# Altium schematic sheet Backplane.SchDoc: Backplane Interface
size A1 portrait; Revision: 1A; SheetNumber: 1; SheetTotal: 1; Organization: Brickworks; Address1: Matthew Glazer; Address2: Design Engineer
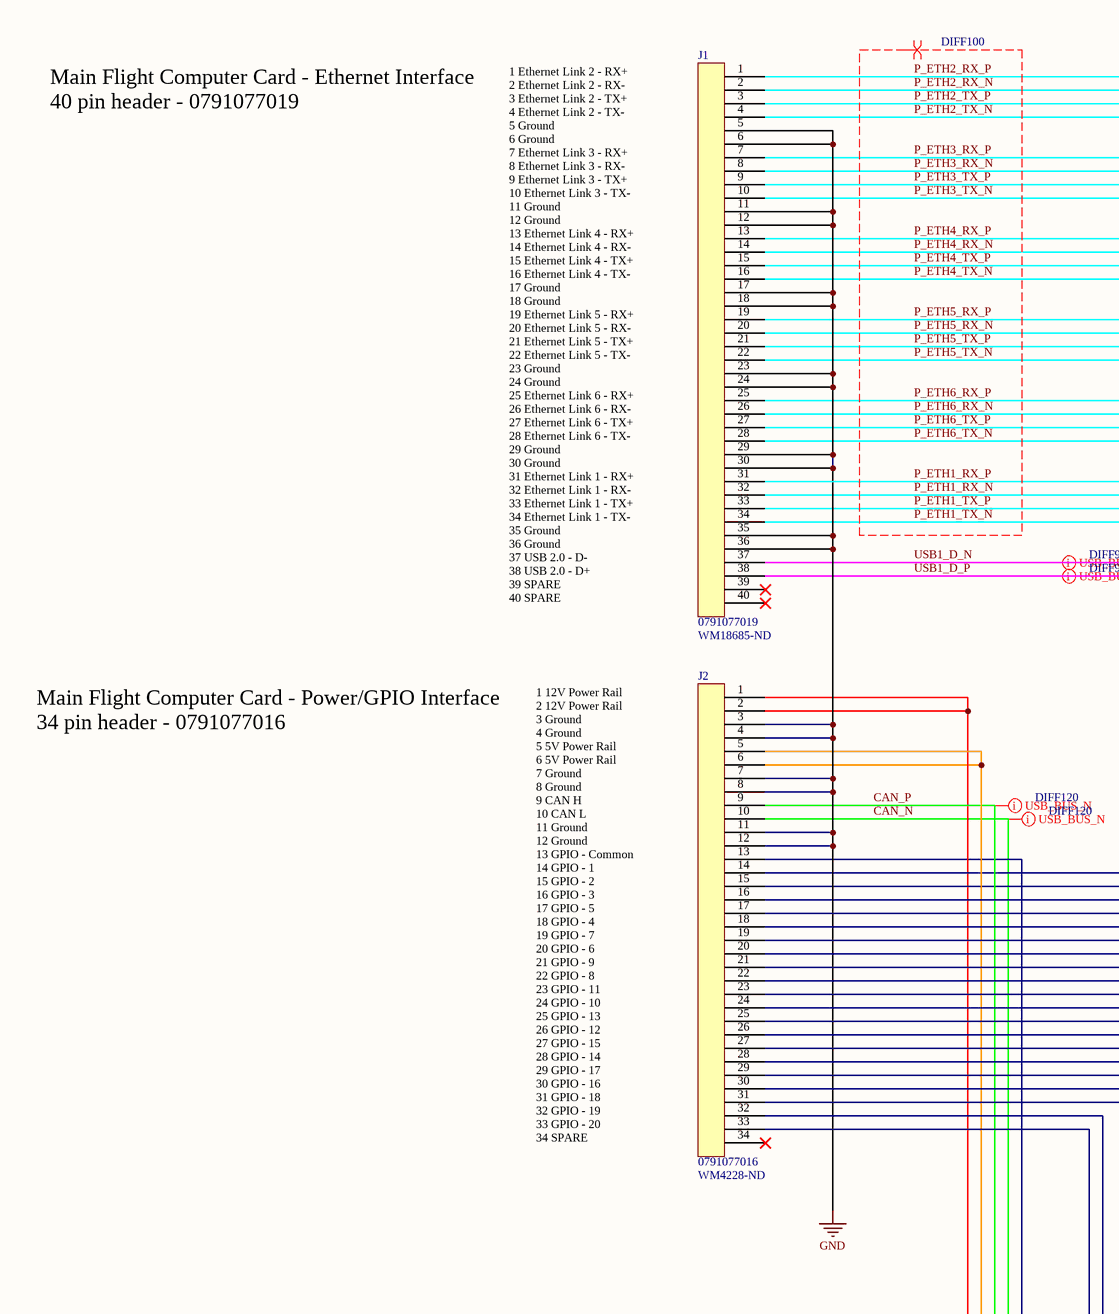
[diagram p0: Backplane.SchDoc, top left]
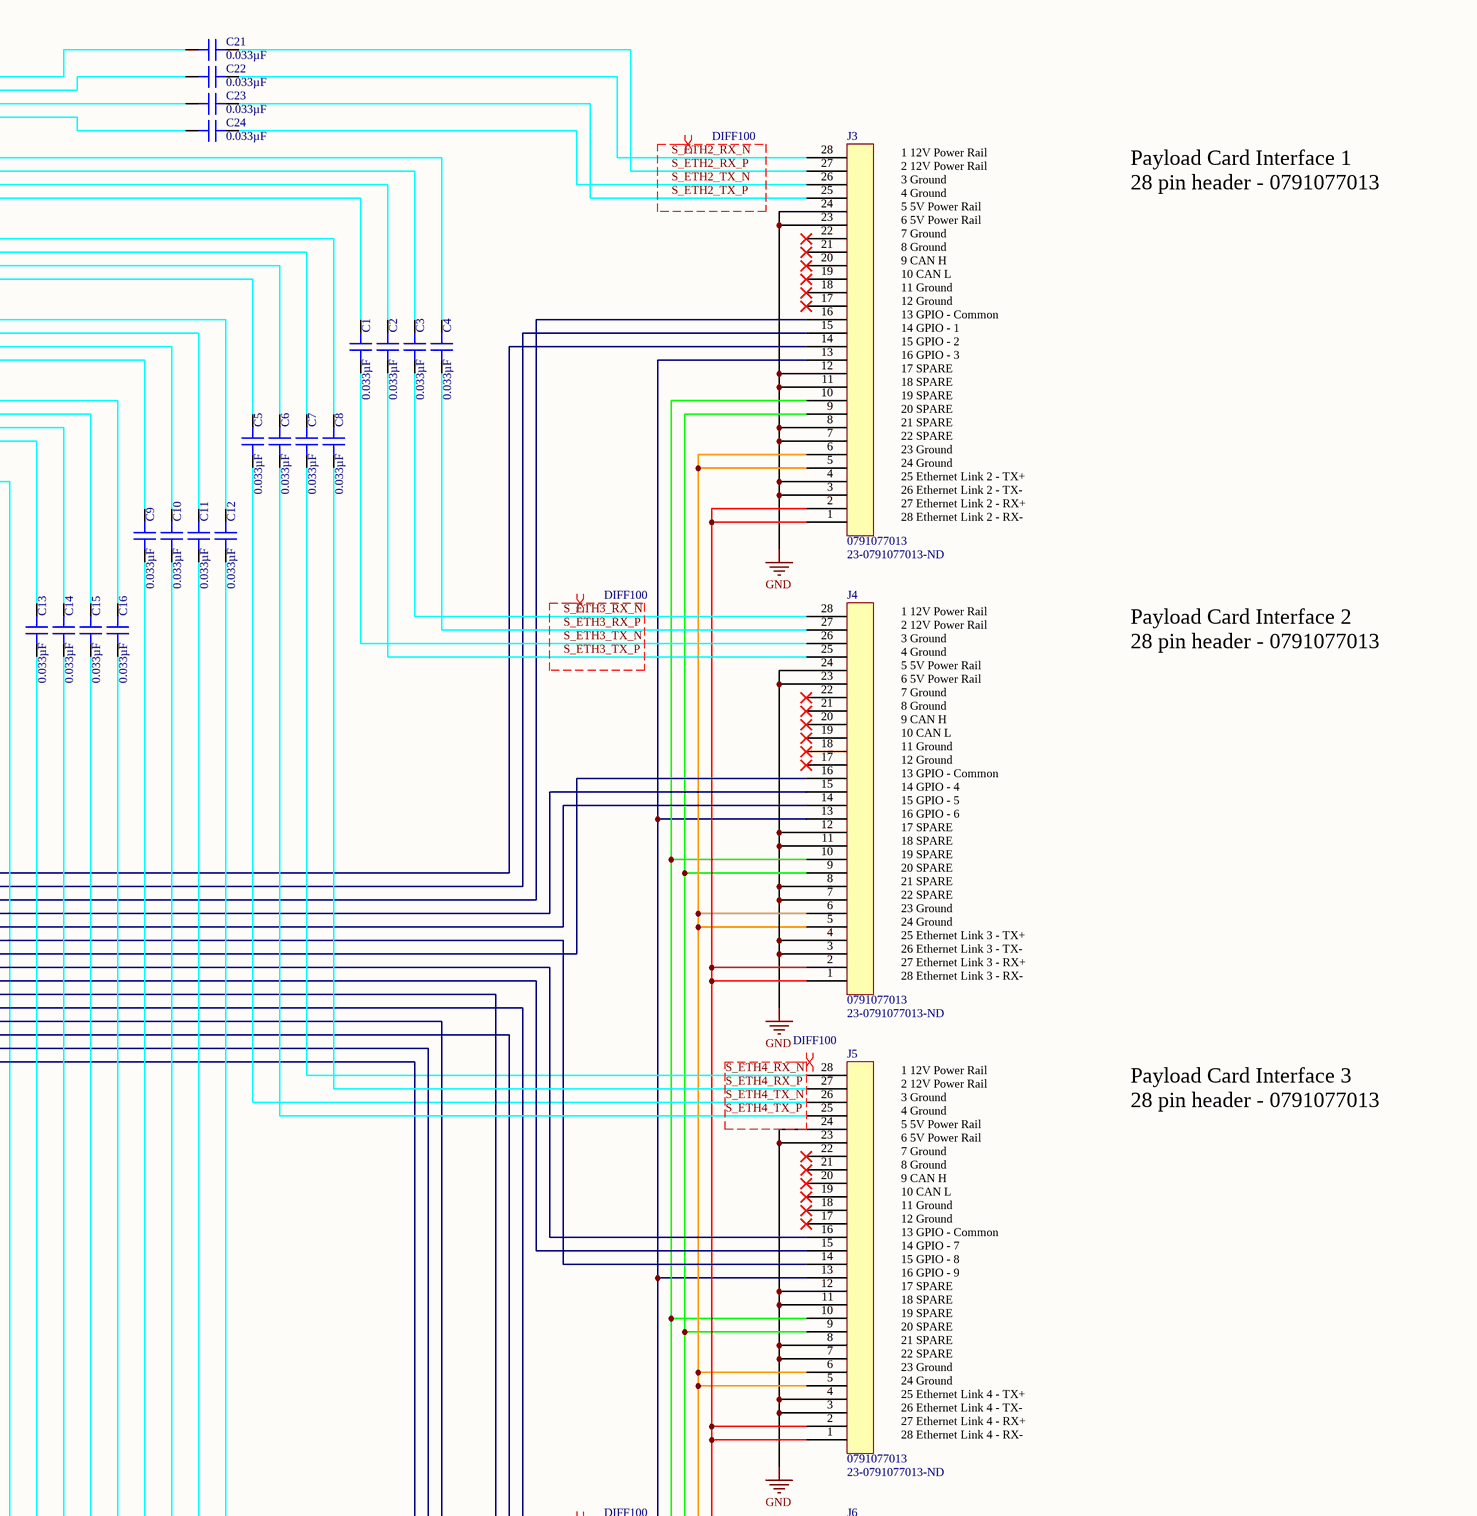
[diagram p1: Backplane.SchDoc, top right]
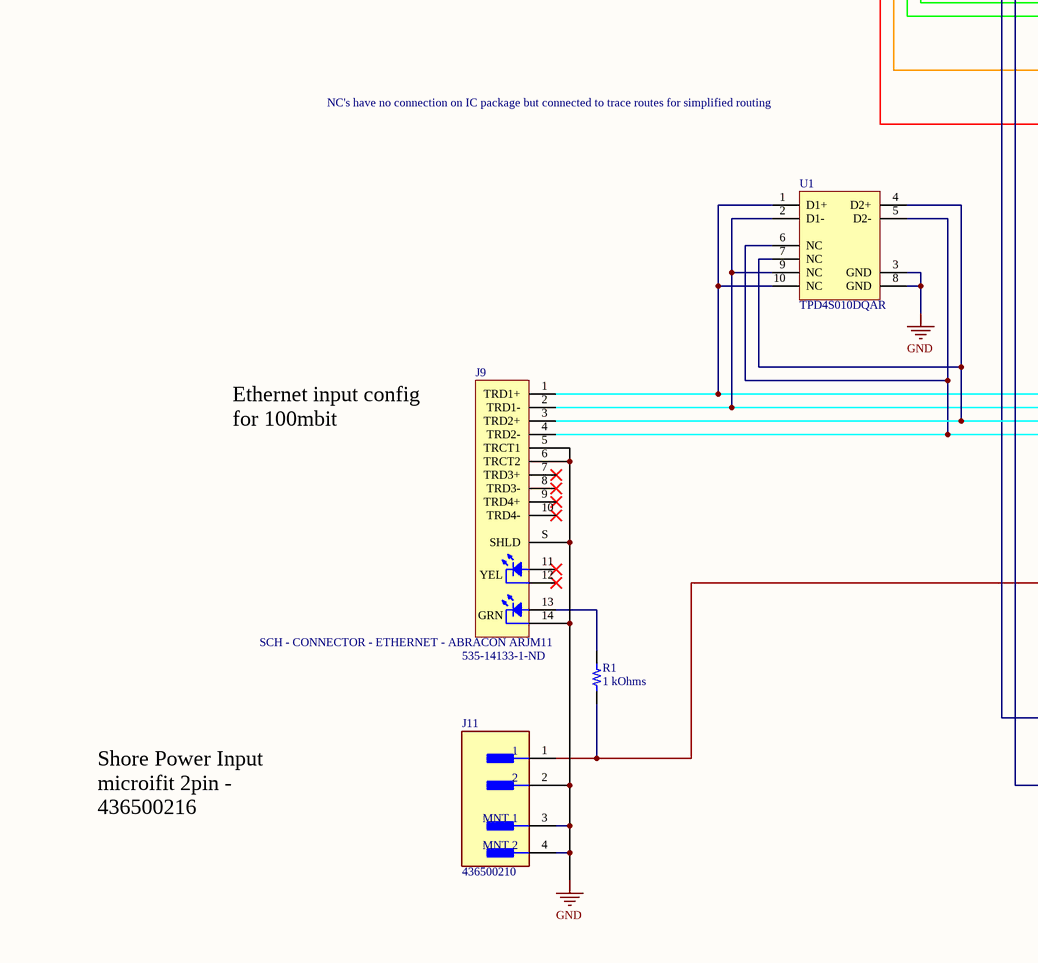
[diagram p2: Backplane.SchDoc, bottom left]
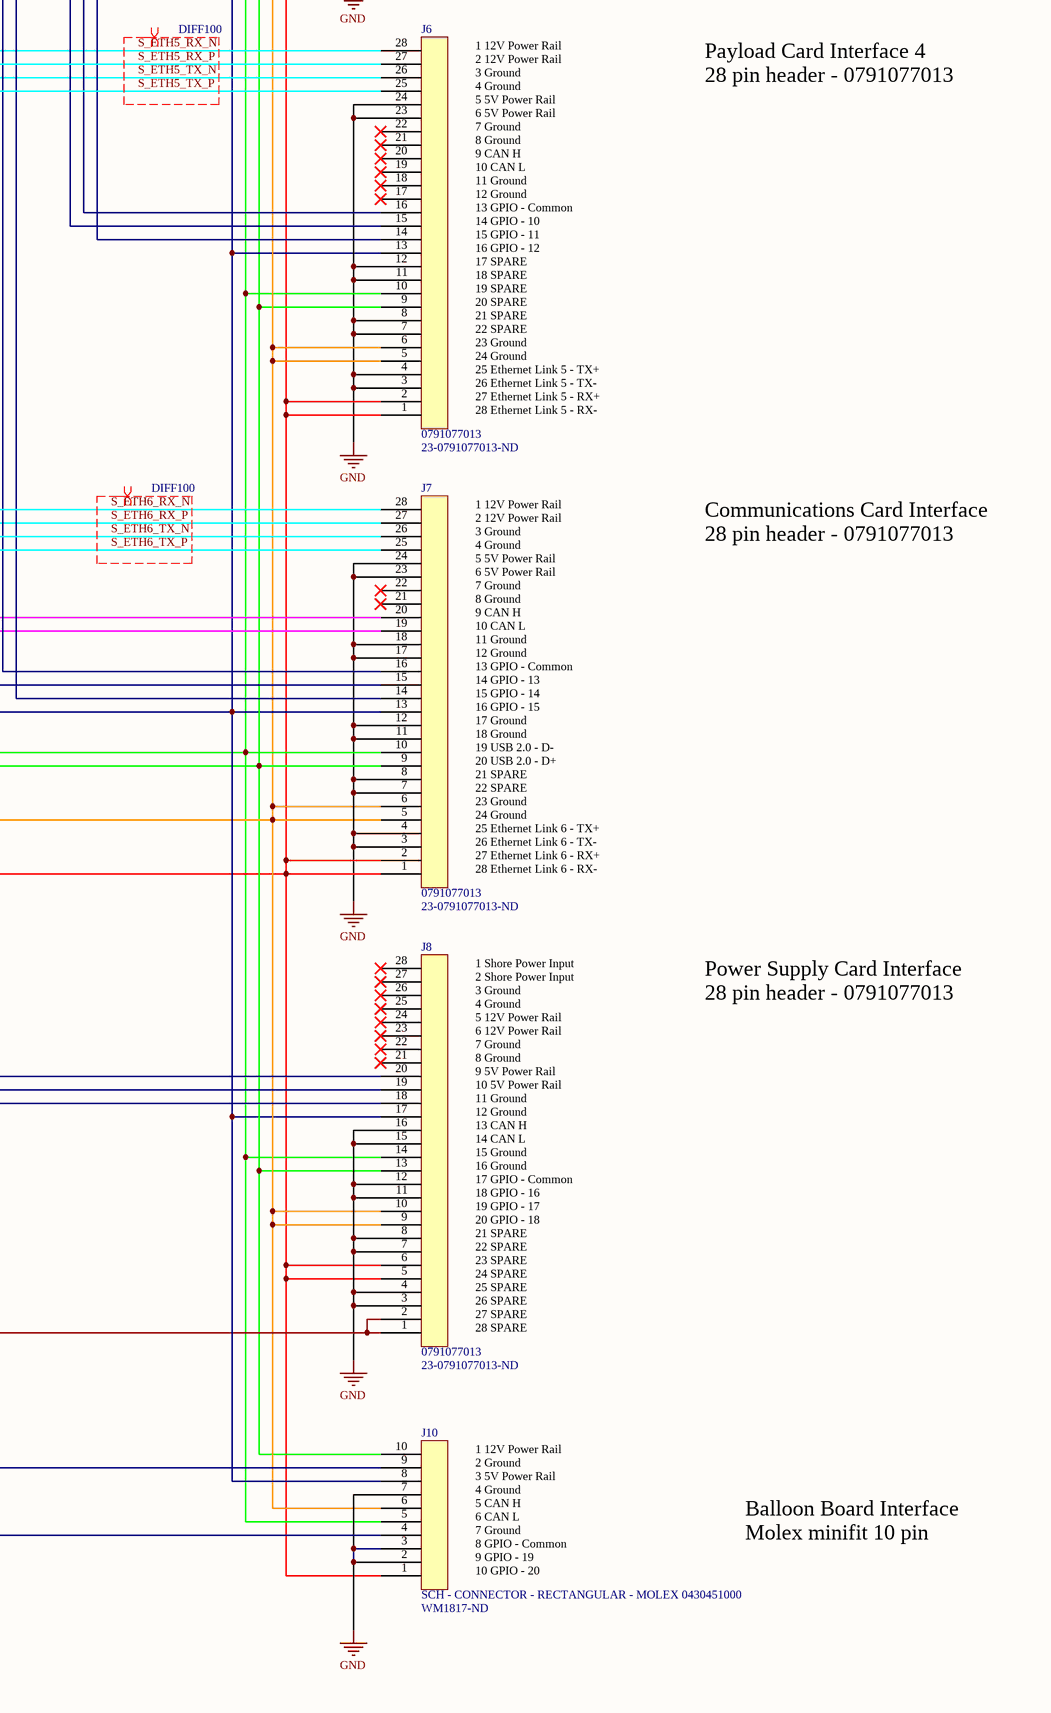
[diagram p3: Backplane.SchDoc, bottom right]

## Parts
C1  0.033µF  [CAP 0603_1608]
C2  0.033µF  [CAP 0603_1608]
C3  0.033µF  [CAP 0603_1608]
C4  0.033µF  [CAP 0603_1608]
C5  0.033µF  [CAP 0603_1608]
C6  0.033µF  [CAP 0603_1608]
C7  0.033µF  [CAP 0603_1608]
C8  0.033µF  [CAP 0603_1608]
C9  0.033µF  [CAP 0603_1608]
C10  0.033µF  [CAP 0603_1608]
C11  0.033µF  [CAP 0603_1608]
C12  0.033µF  [CAP 0603_1608]
C13  0.033µF  [CAP 0603_1608]
C14  0.033µF  [CAP 0603_1608]
C15  0.033µF  [CAP 0603_1608]
C16  0.033µF  [CAP 0603_1608]
C21  0.033µF  [CAP 0603_1608]
C22  0.033µF  [CAP 0603_1608]
C23  0.033µF  [CAP 0603_1608]
C24  0.033µF  [CAP 0603_1608]
J1  0791077019  Supplier Part Number 1: WM18685-ND  [0791077019]
J2  0791077016  Supplier Part Number 1: WM4228-ND  [0791077016]
J3  0791077013  Supplier Part Number 1: 23-0791077013-ND  [0791077013]
J4  0791077013  Supplier Part Number 1: 23-0791077013-ND  [0791077013]
J5  0791077013  Supplier Part Number 1: 23-0791077013-ND  [0791077013]
J6  0791077013  Supplier Part Number 1: 23-0791077013-ND  [0791077013]
J7  0791077013  Supplier Part Number 1: 23-0791077013-ND  [0791077013]
J8  0791077013  Supplier Part Number 1: 23-0791077013-ND  [0791077013]
J9  SCH - CONNECTOR - ETHERNET - ABRACON ARJM11  Supplier Part Number 1: 535-14133-1-ND  [PCB - CONNECTOR - MODULAR - ETHERNET - ABRACON ARJM11]
J10  SCH - CONNECTOR - RECTANGULAR - MOLEX 0430451000  Supplier Part Number 1: WM1817-ND  [PCB - CONNECTOR - RECTANGULAR - MOLEX 0430451000]
J11  436500210  [FP-436500210-MFG]
R1  1 kOhms  [RES 0603_1608]
U1  TPD4S010DQAR  [DQA0010A_V]

## Nets
GND: J1.5 J1.6 J1.11 J1.12 J1.17 J1.18 J1.23 J1.24 J1.29 J1.30 J1.35 J1.36 J2.3 J2.4 J2.7 J2.8 J2.11 J2.12 J3.3 J3.4 J3.7 J3.8 J3.11 J3.12 J3.23 J3.24 J4.3 J4.4 J4.7 J4.8 J4.11 J4.12 J4.23 J4.24 J5.3 J5.4 J5.7 J5.8 J5.11 J5.12 J5.23 J5.24 J6.3 J6.4 J6.7 J6.8 J6.11 J6.12 J6.23 J6.24 J7.3 J7.4 J7.7 J7.8 J7.11 J7.12 J7.17 J7.18 J7.23 J7.24 J8.3 J8.4 J8.7 J8.8 J8.11 J8.12 J8.15 J8.16 J9.5(TRCT1) J9.6(TRCT2) J9.14(L4) J9.S(SHLD) J10.2 J10.3 J10.7 J11.2 J11.3(MNT_1) J11.4(MNT_2) U1.3(GND) U1.8(GND)
CAN_N: J2.10 J3.10 J4.10 J5.10 J6.10 J7.10 J8.14 J10.5
CAN_P: J2.9 J3.9 J4.9 J5.9 J6.9 J7.9 J8.13 J10.10
P_ETH1_RX_N: J1.32 J9.4(TRD2-) U1.5(D2-) U1.6(NC)
P_ETH1_RX_P: J1.31 J9.3(TRD2+) U1.4(D2+) U1.7(NC)
P_ETH1_TX_N: J1.34 J9.2(TRD1-) U1.2(D1-) U1.9(NC)
P_ETH1_TX_P: J1.33 J9.1(TRD1+) U1.1(D1+) U1.10(NC)
P_ETH2_RX_N: C22.2 J1.2
P_ETH2_RX_P: C21.2 J1.1
P_ETH2_TX_N: C24.2 J1.4
P_ETH2_TX_P: C23.2 J1.3
P_ETH3_RX_N: C3.2 J1.8
P_ETH3_RX_P: C4.2 J1.7
P_ETH3_TX_N: C1.2 J1.10
P_ETH3_TX_P: C2.2 J1.9
P_ETH4_RX_N: C7.2 J1.14
P_ETH4_RX_P: C8.2 J1.13
P_ETH4_TX_N: C5.2 J1.16
P_ETH4_TX_P: C6.2 J1.15
P_ETH5_RX_N: C11.2 J1.20
P_ETH5_RX_P: C12.2 J1.19
P_ETH5_TX_N: C9.2 J1.22
P_ETH5_TX_P: C10.2 J1.21
P_ETH6_RX_N: C15.2 J1.26
P_ETH6_RX_P: C16.2 J1.25
P_ETH6_TX_N: C13.2 J1.28
P_ETH6_TX_P: C14.2 J1.27
S_ETH2_RX_N: C22.1 J3.28
S_ETH2_RX_P: C21.1 J3.27
S_ETH2_TX_N: C24.1 J3.26
S_ETH2_TX_P: C23.1 J3.25
S_ETH3_RX_N: C3.1 J4.28
S_ETH3_RX_P: C4.1 J4.27
S_ETH3_TX_N: C1.1 J4.26
S_ETH3_TX_P: C2.1 J4.25
S_ETH4_RX_N: C7.1 J5.28
S_ETH4_RX_P: C8.1 J5.27
S_ETH4_TX_N: C5.1 J5.26
S_ETH4_TX_P: C6.1 J5.25
S_ETH5_RX_N: C11.1 J6.28
S_ETH5_RX_P: C12.1 J6.27
S_ETH5_TX_N: C9.1 J6.26
S_ETH5_TX_P: C10.1 J6.25
S_ETH6_RX_N: C15.1 J7.28
S_ETH6_RX_P: C16.1 J7.27
S_ETH6_TX_N: C13.1 J7.26
S_ETH6_TX_P: C14.1 J7.25
USB1_D_N: J1.37 J7.19
USB1_D_P: J1.38 J7.20
NetJ2_1: J2.1 J2.2 J3.1 J3.2 J4.1 J4.2 J5.1 J5.2 J6.1 J6.2 J7.1 J7.2 J8.5 J8.6 J10.1
NetJ2_5: J2.5 J2.6 J3.5 J3.6 J4.5 J4.6 J5.5 J5.6 J6.5 J6.6 J7.5 J7.6 J8.9 J8.10 J10.6
NetJ2_13: J2.13 J3.13 J4.13 J5.13 J6.13 J7.13 J8.17 J10.8
NetJ2_14: J2.14 J3.14
NetJ2_15: J2.15 J3.15
NetJ2_16: J2.16 J3.16
NetJ2_17: J2.17 J4.15
NetJ2_18: J2.18 J4.14
NetJ2_19: J2.19 J5.14
NetJ2_20: J2.20 J4.16
NetJ2_21: J2.21 J5.16
NetJ2_22: J2.22 J5.15
NetJ2_23: J2.23 J6.15
NetJ2_24: J2.24 J6.14
NetJ2_25: J2.25 J7.14
NetJ2_26: J2.26 J6.16
NetJ2_27: J2.27 J7.16
NetJ2_28: J2.28 J7.15
NetJ2_29: J2.29 J8.19
NetJ2_30: J2.30 J8.18
NetJ2_31: J2.31 J8.20
NetJ2_32: J2.32 J10.4
NetJ2_33: J2.33 J10.9
NetJ8_1: J8.1 J8.2 J11.1 R1.2
NetJ9_13: J9.13(L3) R1.1

Not connected (* = marked no-connect by the designer): J1 39* 40*; J2 34*; J3 17* 18* 19* 20* 21* 22*; J4 17* 18* 19* 20* 21* 22*; J5 17* 18* 19* 20* 21* 22*; J6 17* 18* 19* 20* 21* 22*; J7 21* 22*; J8 21* 22* 23* 24* 25* 26* 27* 28*; J9 7(TRD3+)* 8(TRD3-)* 9(TRD4+)* 10(TRD4-)* 11(L1)* 12(L2)*

## Layout directives
differential pair; differential pair class DIFF100: P_ETH1_RX_N, P_ETH1_RX_P, P_ETH1_TX_N, P_ETH1_TX_P, P_ETH2_RX_N, P_ETH2_RX_P, P_ETH2_TX_N, P_ETH2_TX_P, P_ETH3_RX_N, P_ETH3_RX_P, P_ETH3_TX_N, P_ETH3_TX_P, P_ETH4_RX_N, P_ETH4_RX_P, P_ETH4_TX_N, P_ETH4_TX_P, P_ETH5_RX_N, P_ETH5_RX_P, P_ETH5_TX_N, P_ETH5_TX_P, P_ETH6_RX_N, P_ETH6_RX_P, P_ETH6_TX_N, P_ETH6_TX_P, S_ETH2_RX_N, S_ETH2_RX_P, S_ETH2_TX_N, S_ETH2_TX_P, S_ETH3_RX_N, S_ETH3_RX_P, S_ETH3_TX_N, S_ETH3_TX_P, S_ETH4_RX_N, S_ETH4_RX_P, S_ETH4_TX_N, S_ETH4_TX_P, S_ETH5_RX_N, S_ETH5_RX_P, S_ETH5_TX_N, S_ETH5_TX_P, S_ETH6_RX_N, S_ETH6_RX_P, S_ETH6_TX_N, S_ETH6_TX_P
differential pair; differential pair class DIFF90: USB1_D_N, USB1_D_P
differential pair; differential pair class DIFF120: CAN_N, CAN_P

## Notes on the sheet
- Main Flight Computer Card - Ethernet Interface
  40 pin header - 0791077019
- Payload Card Interface 1
  28 pin header - 0791077013
- 1	12V Power Rail
  2	12V Power Rail
  3	Ground
  4	Ground
  5	5V Power Rail
  6	5V Power Rail
  7	Ground
  8	Ground
  9	CAN H
  10	CAN L
  11	Ground
  12	Ground
  13	GPIO - Common
  14	GPIO - 1
  15	GPIO - 2
  16	GPIO - 3
  17	SPARE
  18	SPARE
  19	SPARE
  20	SPARE
  21	SPARE
  22	SPARE
  23	Ground
  24	Ground
  25	Ethernet Link 2 - TX+
  26	Ethernet Link 2 - TX-
  27	Ethernet Link 2 - RX+
  28	Ethernet Link 2 - RX-
- (near J1) 1	Ethernet Link 2 - RX+
  2	Ethernet Link 2 - RX-
  3	Ethernet Link 2 - TX+
  4	Ethernet Link 2 - TX-
  5	Ground
  6	Ground
  7	Ethernet Link 3 - RX+
  8	Ethernet Link 3 - RX-
  9	Ethernet Link 3 - TX+
  10	Ethernet Link 3 - TX-
  11	Ground
  12	Ground
  13	Ethernet Link 4 - RX+
  14	Ethernet Link 4 - RX-
  15	Ethernet Link 4 - TX+
  16	Ethernet Link 4 - TX-
  17	Ground
  18	Ground
  19	Ethernet Link 5 - RX+
  20	Ethernet Link 5 - RX-
  21	Ethernet Link 5 - TX+
  22	Ethernet Link 5 - TX-
  23	Ground
  24	Ground
  25	Ethernet Link 6 - RX+
  26	Ethernet Link 6 - RX-
  27	Ethernet Link 6 - TX+
  28	Ethernet Link 6 - TX-
  29	Ground
  30	Ground
  31	Ethernet Link 1 - RX+
  32	Ethernet Link 1 - RX-
  33	Ethernet Link 1 - TX+
  34	Ethernet Link 1 - TX-
  35	Ground
  36	Ground
  37	USB 2.0 - D-
  38	USB 2.0 - D+
  39	SPARE
  40	SPARE
- Payload Card Interface 2
  28 pin header - 0791077013
- Main Flight Computer Card - Power/GPIO Interface
  34 pin header - 0791077016
- 1	12V Power Rail
  2	12V Power Rail
  3	Ground
  4	Ground
  5	5V Power Rail
  6	5V Power Rail
  7	Ground
  8	Ground
  9	CAN H
  10	CAN L
  11	Ground
  12	Ground
  13	GPIO - Common
  14	GPIO - 4
  15	GPIO - 5
  16	GPIO - 6
  17	SPARE
  18	SPARE
  19	SPARE
  20	SPARE
  21	SPARE
  22	SPARE
  23	Ground
  24	Ground
  25	Ethernet Link 3 - TX+
  26	Ethernet Link 3 - TX-
  27	Ethernet Link 3 - RX+
  28	Ethernet Link 3 - RX-
- Payload Card Interface 3
  28 pin header - 0791077013
- (near J2) 1	12V Power Rail
  2	12V Power Rail
  3	Ground
  4	Ground
  5	5V Power Rail
  6	5V Power Rail
  7	Ground
  8	Ground
  9	CAN H
  10	CAN L
  11	Ground
  12	Ground
  13	GPIO - Common
  14	GPIO - 1
  15	GPIO - 2
  16	GPIO - 3
  17	GPIO - 5
  18	GPIO - 4
  19	GPIO - 7
  20	GPIO - 6
  21	GPIO - 9
  22	GPIO - 8
  23	GPIO - 11
  24	GPIO - 10
  25	GPIO - 13
  26	GPIO - 12
  27	GPIO - 15
  28	GPIO - 14
  29	GPIO - 17
  30	GPIO - 16
  31	GPIO - 18
  32	GPIO - 19
  33	GPIO - 20
  34	SPARE
- 1	12V Power Rail
  2	12V Power Rail
  3	Ground
  4	Ground
  5	5V Power Rail
  6	5V Power Rail
  7	Ground
  8	Ground
  9	CAN H
  10	CAN L
  11	Ground
  12	Ground
  13	GPIO - Common
  14	GPIO - 7
  15	GPIO - 8
  16	GPIO - 9
  17	SPARE
  18	SPARE
  19	SPARE
  20	SPARE
  21	SPARE
  22	SPARE
  23	Ground
  24	Ground
  25	Ethernet Link 4 - TX+
  26	Ethernet Link 4 - TX-
  27	Ethernet Link 4 - RX+
  28	Ethernet Link 4 - RX-
- Payload Card Interface 4
  28 pin header - 0791077013
- 1	12V Power Rail
  2	12V Power Rail
  3	Ground
  4	Ground
  5	5V Power Rail
  6	5V Power Rail
  7	Ground
  8	Ground
  9	CAN H
  10	CAN L
  11	Ground
  12	Ground
  13	GPIO - Common
  14	GPIO - 10
  15	GPIO - 11
  16	GPIO - 12
  17	SPARE
  18	SPARE
  19	SPARE
  20	SPARE
  21	SPARE
  22	SPARE
  23	Ground
  24	Ground
  25	Ethernet Link 5 - TX+
  26	Ethernet Link 5 - TX-
  27	Ethernet Link 5 - RX+
  28	Ethernet Link 5 - RX-
- Communications Card Interface
  28 pin header - 0791077013
- NC's have no connection on IC package but connected to trace routes for simplified routing
- 1	12V Power Rail
  2	12V Power Rail
  3	Ground
  4	Ground
  5	5V Power Rail
  6	5V Power Rail
  7	Ground
  8	Ground
  9	CAN H
  10	CAN L
  11	Ground
  12	Ground
  13	GPIO - Common
  14	GPIO - 13
  15	GPIO - 14
  16	GPIO - 15
  17	Ground
  18	Ground
  19	USB 2.0 - D-
  20	USB 2.0 - D+
  21	SPARE
  22	SPARE
  23	Ground
  24	Ground
  25	Ethernet Link 6 - TX+
  26	Ethernet Link 6 - TX-
  27	Ethernet Link 6 - RX+
  28	Ethernet Link 6 - RX-
- Power Supply Card Interface
  28 pin header - 0791077013
- Ethernet input config for 100mbit
- 1	Shore Power Input
  2	Shore Power Input
  3	Ground
  4	Ground
  5	12V Power Rail
  6	12V Power Rail
  7	Ground
  8	Ground
  9	5V Power Rail
  10	5V Power Rail
  11	Ground
  12	Ground
  13	CAN H
  14	CAN L
  15	Ground
  16	Ground
  17	GPIO - Common
  18	GPIO - 16
  19	GPIO - 17
  20	GPIO - 18
  21	SPARE
  22	SPARE
  23	SPARE
  24	SPARE
  25	SPARE
  26	SPARE
  27	SPARE
  28	SPARE
- Shore Power Input
  microifit 2pin - 436500216
  Cable: 1451320200
- 1	12V Power Rail
  2	Ground
  3	5V Power Rail
  4	Ground
  5	CAN H
  6	CAN L
  7	Ground
  8	GPIO - Common
  9	GPIO - 19
  10	GPIO - 20
- Balloon Board Interface
  Molex minifit 10 pin
- Title
- Size:
- Date:
- File:
- A1
- Number:
- Time:
- Revision:
- Sheet
- of
- (in symbol SCH - CONNECTOR - ETHERNET - ABRACON ARJM11) YEL; GRN

## Library data of the parts
C1-C16 C21-C24 = CL10B333KB8NFNC: CAP CER 0.033UF 50V X7R 0603; Manufacturer: Samsung Electro-Mechanics; Tolerance: ±10%; Part Number: CL10B333KB8NFNC; Value: 0.033µF; Applications: General Purpose; Capacitance: 0.033µF; ComponentLink1Description: Datasheet; ComponentLink1URL: http://www.samsungsem.com/kr/support/product-search/mlcc/CL10B333KB8NFNC.jsp; ComponentLink2Description: DigiKey Link; ComponentLink2URL: http://digikey.com/product-detail/en/samsung-electro-mechanics/CL10B333KB8NFNC/1276-2040-1-ND/3890126; Device Package: 0603 (1608 Metric); LastUpdated: 8/13/2020 10:21:44 AM; Lifecycle Status: Active; Minimum Order: 1; Mounting Type: Surface Mount, MLCC; Operating Temperature: -55°C ~ 125°C; Package / Case: 0603 (1608 Metric); Packaging: TapeAndReel; PartId: 14254; Part Status: Active; Price: 0.01; Series: CL; Size / Dimension: 0.063" L x 0.031" W (1.60mm x 0.80mm); Supplier 1: DigiKey; Supplier Part Number 1: 1276-2040-1-ND; Temperature Coefficient: X7R; Thickness (Max): 0.035" (0.90mm)
J11 = CMP-04776-000082-1: CONN HEADER SMD R/A 2POS 3MM; Manufacturer: Molex; Voltage Rating: 600V; Current Rating: 8.5A; Conn Orientation: Right Angle; Number Of Contacts: 2; Conn Gender: Male; Device Class L3: unset; Contact Material: Gold,Nickel; RoHS: TRUE; Number Of Rows: 1; Manufacturer Part Number: 436500210; Category: Conn; Footprint Url: https://www.molex.com/pdm_docs/sd/436500210_sd.pdf; Temperature Range High: +105°C; Package: 436500210; Pitch: 3mm; Temperature: -40°C to +105°C; Height: 6.07mm; Lead Free: Yes; ComponentLink2Description: Datasheet; Temperature Range Low: -40°C; Digikey Description: CONN HEADER SMD R/A 2POS 3MM; Device Class L1: Connectors; Mouser Description: Conn Power HDR 2 POS 3mm Solder RA SMD 2 Terminal 1 Port Embossed T/R; ComponentLink2URL: https://www.molex.com/webdocs/datasheets/pdf/en-us/0436500210_PCB_HEADERS.pdf; Octopart: https://octopart.com/43650-0210-molex-298097; Automotive: No; Device Class L2: Headers and Wire Housings
R1 = RNCP0603FTD1K00: RES 1K OHM 1% 1/8W 0603; Manufacturer: Stackpole Electronics Inc; Power (Watts): 0.125W, 1/8W; Temperature Coefficient: ±100ppm/°C; Part Number: RNCP0603FTD1K00; Value: 1 kOhms; ComponentLink1Description: Datasheet; ComponentLink1URL: https://www.seielect.com/catalog/sei-rncp.pdf; ComponentLink2Description: DigiKey Link; ComponentLink2URL: http://digikey.com/product-detail/en/stackpole-electronics-inc/RNCP0603FTD1K00/RNCP0603FTD1K00CT-ND/2240445; Composition: Thin Film; Device Package: 0603 (1608 Metric); Features: Anti-Sulfur, Moisture Resistant; Height - Seated (Max): 0.020" (0.50mm); LastUpdated: 9/2/2020 1:10:23 AM; Lifecycle Status: Active; Minimum Order: 1; Number of Terminations: 2; Operating Temperature: -55°C ~ 155°C; Package / Case: 0603 (1608 Metric); Packaging: TapeAndReel; PartId: 5694; Part Status: Active; Price: 0.01; Resistance: 1 kOhms; Series: RNCP; Size / Dimension: 0.059" L x 0.031" W (1.50mm x 0.80mm); Supplier 1: DigiKey; Supplier Part Number 1: RNCP0603FTD1K00CT-ND; Supplier Device Package: 0603; Tolerance: ±1%
U1 = CMP-0326-00026-3: ESD Solution for High-Speed Differential Interface, 4 Channels, -40 to +85 degC,10-pin SON (DQA), Green (RoHS & no Sb/Br); Manufacturer: Texas Instruments; Differential Capacitance(pF): 0.05; IEC 61000-4-2 Contact(+/- kV): 8; IO Capacitance(Typ)(pF): 0.8; Breakdown Voltage(Min)(V): 9; Serial ATA / eSATA: TRUE; IO Leakage Current(nA): 10; PackageVersion: revB, Sep-2009; ComponentLink2Description: Datasheet; ComponentLink3URL: SamplesURL:http://www.ti.com/product/tpd4s010#samples; ComponentLink2URL: http://www.ti.com/general/docs/lit/getliterature.tsp?genericPartNumber=TPD4S010&fileType=pdf; Mounting Technology: Surface Mount; IEC 61000-4-2 Air-Gap(+/- kV): 9; PartNumber: TPD4S010DQAR; ComponentLink3Description: URL Link1; DatasheetVersion: SLVS817E; ComponentLink1Description: Manufacturer URL; PackageDescription: 10-Pin Plastic Small Outline No-Lead, 1 x 2.5 x 0.55 mm Body, 0.5 mm Pitch; Eco-Plan: Green (RoHS & no Sb/Br); ComponentLink1URL: http://www.ti.com/; PackageReference: DQA0010A; SubFamily: ESD Solution; 1394 / Firewire: TRUE
J1 = 0791077019: Supplier 1: Digi-Key
J2 = 0791077016: Supplier 1: Digi-Key
J3-J8 = 0791077013: Supplier 1: Digi-Key
J9 = SCH - CONNECTOR - ETHERNET - ABRACON ARJM11: Supplier 1: Digi-Key
J10 = SCH - CONNECTOR - RECTANGULAR - MOLEX 0430451000: Supplier 1: Digi-Key